# Altium schematic sheet Main.SchDoc
size 420 x 297 mm; SheetNumber: 1; SheetTotal: 4
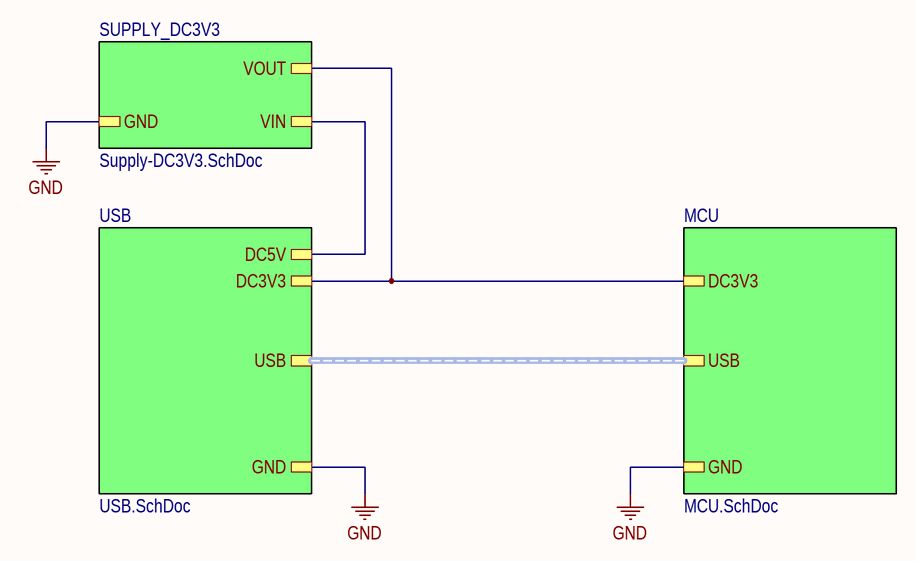
[diagram p0: Main.SchDoc]

## Sub-sheets
MCU = MCU.SchDoc: USB (harness USB), DC3V3, GND
SUPPLY_DC3V3 = Supply-DC3V3.SchDoc: VIN, VOUT, GND
USB = USB.SchDoc: USB (harness USB), DC5V, DC3V3, GND

## Nets
GND: sheet MCU/GND, sheet USB/GND, sheet SUPPLY_DC3V3/GND
(unnamed): sheet MCU/DC3V3, sheet USB/DC3V3, sheet SUPPLY_DC3V3/VOUT
(unnamed): sheet USB/DC5V, sheet SUPPLY_DC3V3/VIN

## Buses and harness runs
harness sheet MCU/USB = sheet USB/USB

## Notes on the sheet
- Подп. и дата
- Инв. № дубл.
- Взам. инв. №
- Изм.
- Разраб.
- Лист
- № докум.
- Подп.
- Дата
- Лит.
- Масса
- Масштаб
- Утв.
- Листов
- Инв № подл.
- Формат А3